# EAGLE design RDF-600 (EAGLE 7.0.0)
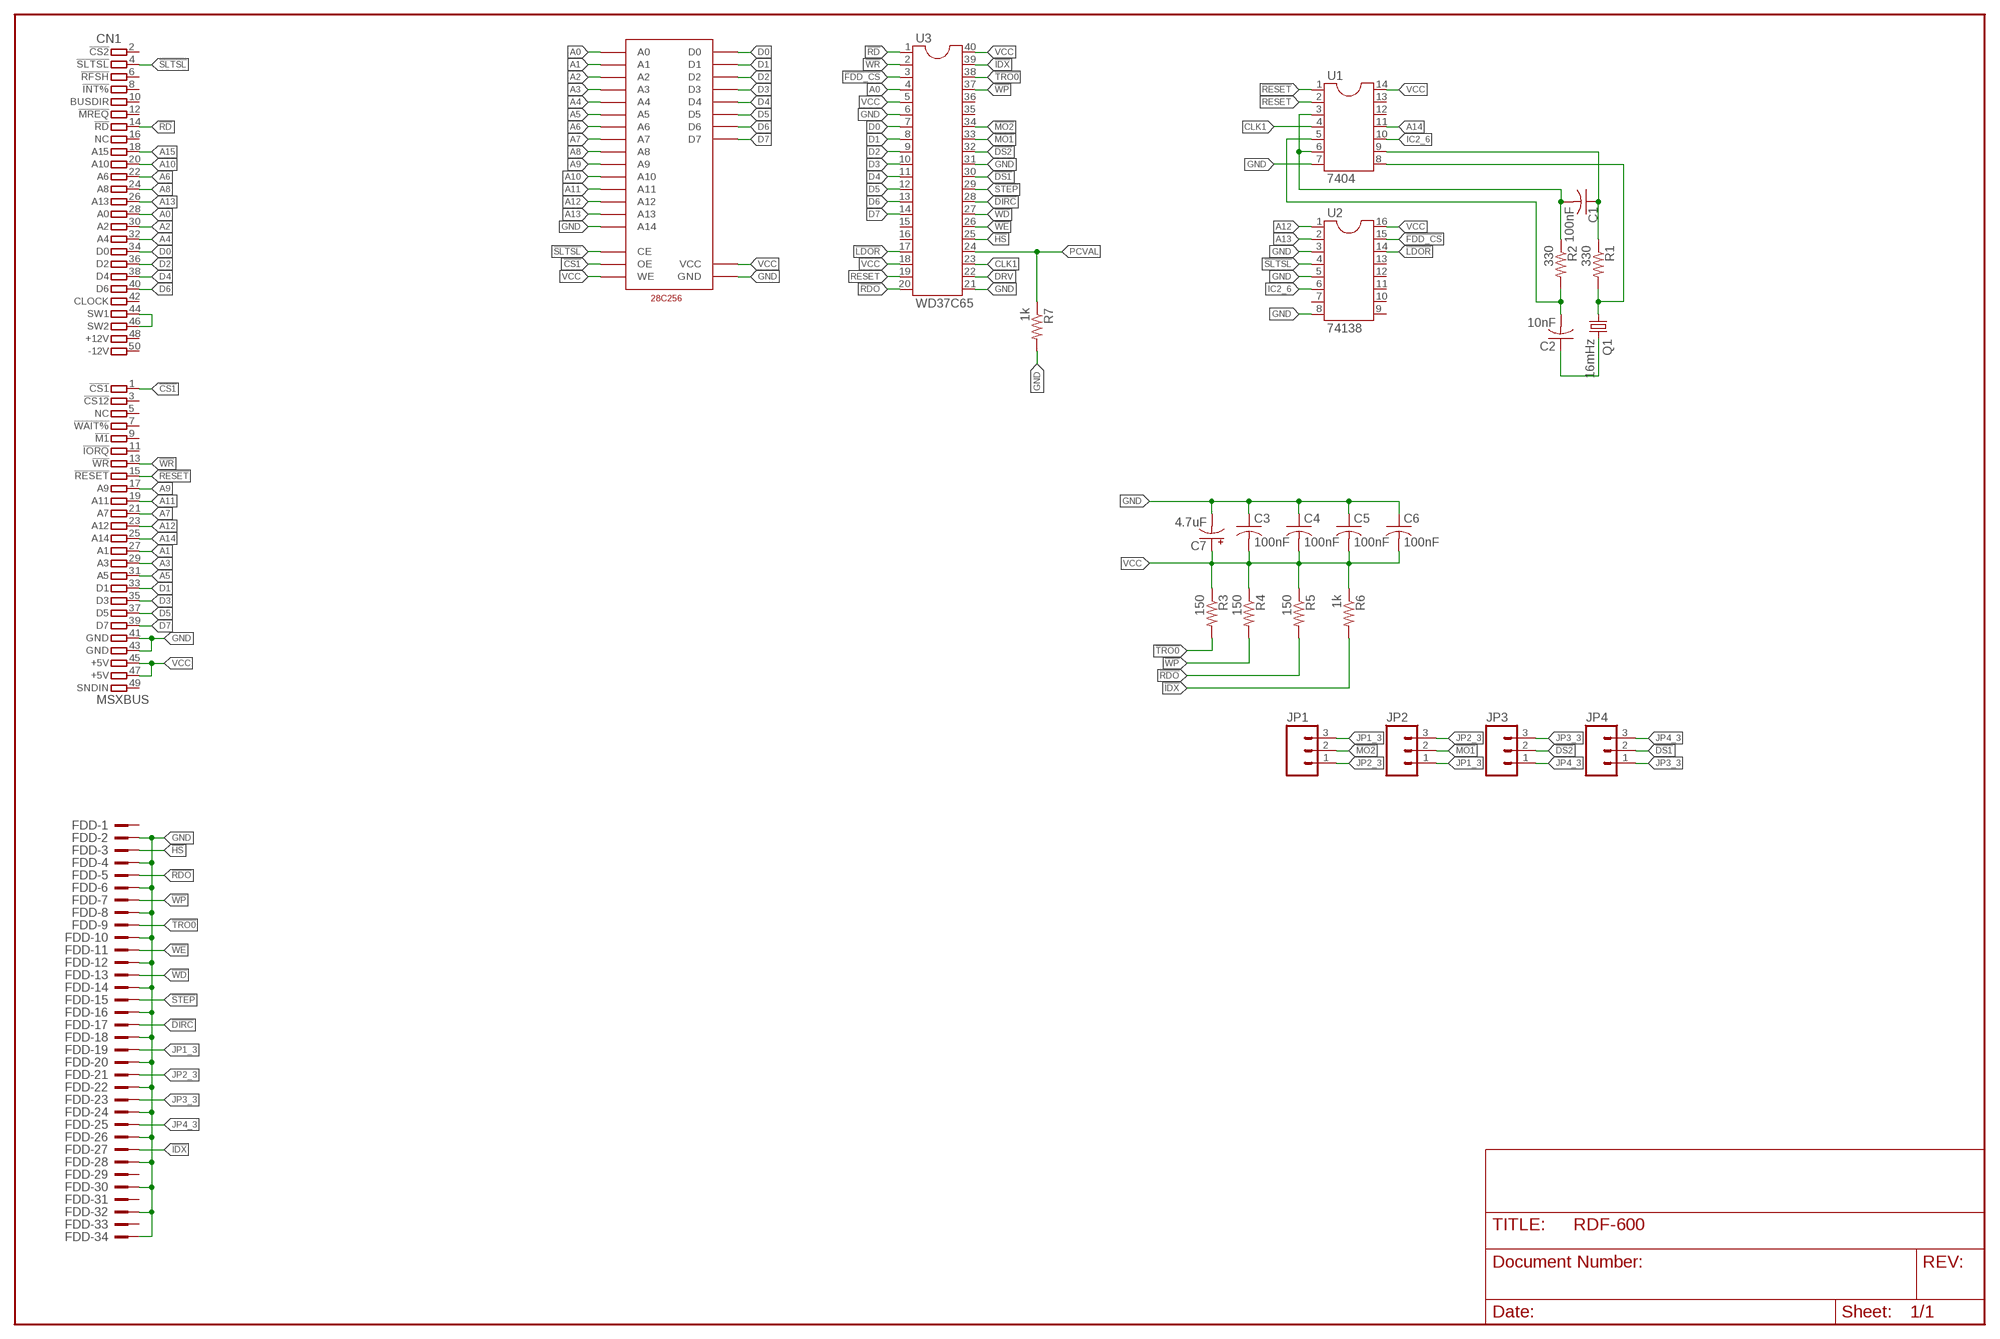
[diagram p0: schematic, sheet 1]

## Parts
28C256  28C256  [DIP28]
C1  100nF  C-US025-025X050  [C025-025X050]
C2  10nF  C-US025-025X050  [C025-025X050]
C3  100nF  C-US025-025X050  [C025-025X050]
C4  100nF  C-US025-025X050  [C025-025X050]
C5  100nF  C-US025-025X050  [C025-025X050]
C6  100nF  C-US025-025X050  [C025-025X050]
C7  4.7uF  CPOL-USE2,5-6E  [E2,5-6E]
CN1  MSXBUS  MSXBUS_EDGE  [MSXBUS_EDGECONN]
FDD  2534-5  [PAK100/2500-5-34]
JP1  M03PTH  [1X03]
JP2  M03PTH  [1X03]
JP3  M03PTH  [1X03]
JP4  M03PTH  [1X03]
Q1  16mHz  CRYSTALHC49S  [HC49/S]
R1  330  R-US_0207/7  [0207/7]
R2  330  R-US_0207/7  [0207/7]
R3  150  R-US_0207/7  [0207/7]
R4  150  R-US_0207/7  [0207/7]
R5  150  R-US_0207/7  [0207/7]
R6  1k  R-US_0207/7  [0207/7]
R7  1k  R-US_0207/7  [0207/7]
U1  7404  DIL14  [DIL14]
U2  74138  DIL16  [DIL16]
U3  WD37C65  DIL40  [DIL40]

## Nets
!CS1: 28C256.P$22(OE) CN1.1(1.!CS1)
!DIRC: FDD.17 U3.28
!DS1: JP4.2 U3.30
!DS2: JP3.2 U3.32
!FDD_CS: U2.15 U3.3
!HS: FDD.3 U3.25
!IDX: FDD.27 R6.2 U3.39
!LDOR: U2.14 U3.17
!MO1: JP2.2 U3.33
!MO2: JP1.2 U3.34
!RD: CN1.14(14.!RD) U3.1
!RDO: FDD.5 R5.2 U3.20
!RESET: CN1.15(15.!RESET) U1.1
!SLTSL: 28C256.P$20(CE) CN1.4(4.!SLTSL) U2.4
!STEP: FDD.15 U3.29
!TRO0: FDD.9 R3.2 U3.38
!WD: FDD.13 U3.27
!WE: FDD.11 U3.26
!WP: FDD.7 R4.2 U3.37
!WR: CN1.13(13.!WR) U3.2
A0: 28C256.P$10(A0) CN1.28(28.A0) U3.4
A1: 28C256.P$9(A1) CN1.27(27.A1)
A2: 28C256.P$8(A2) CN1.30(30.A2)
A3: 28C256.P$7(A3) CN1.29(29.A3)
A4: 28C256.P$6(A4) CN1.32(32.A4)
A5: 28C256.P$5(A5) CN1.31(31.A5)
A6: 28C256.P$4(A6) CN1.22(22.A6)
A7: 28C256.P$3(A7) CN1.21(21.A7)
A8: 28C256.P$25(A8) CN1.24(24.A8)
A9: 28C256.P$24(A9) CN1.17(17.A9)
A10: 28C256.P$21(A10) CN1.20(20.A10)
A11: 28C256.P$23(A11) CN1.19(19.A11)
A12: 28C256.P$2(A12) CN1.23(23.A12) U2.1
A13: 28C256.P$26(A13) CN1.26(26.A13) U2.2
A14: CN1.25(25.A14) U1.11
A15: CN1.18(18.A15)
CLK1: U1.4 U3.23
D0: 28C256.P$11(D0) CN1.34(34.D0) U3.7
D1: 28C256.P$12(D1) CN1.33(33.D1) U3.8
D2: 28C256.P$13(D2) CN1.36(36.D2) U3.9
D3: 28C256.P$15(D3) CN1.35(35.D3) U3.10
D4: 28C256.P$16(D4) CN1.38(38.D4) U3.11
D5: 28C256.P$17(D5) CN1.37(37.D5) U3.12
D6: 28C256.P$18(D6) CN1.40(40.D6) U3.13
D7: 28C256.P$19(D7) CN1.39(39.D7) U3.14
DRV: U3.22
GND: 28C256.P$1(A14) 28C256.P$14(GND) C3.1 C4.1 C5.1 C6.1 C7.- CN1.41(41.GND) CN1.43(43.GND) FDD.2 FDD.4 FDD.6 FDD.8 FDD.10 FDD.12 FDD.14 FDD.16 FDD.18 FDD.20 FDD.22 FDD.24 FDD.26 FDD.28 FDD.30 FDD.32 FDD.34 R7.2 U1.7 U2.3 U2.5 U2.8 U3.6 U3.21 U3.31
IC2_6: U1.10 U2.6
JP1_3: FDD.19 JP1.3 JP2.1
JP2_3: FDD.21 JP1.1 JP2.3
JP3_3: FDD.23 JP3.3 JP4.1
JP4_3: FDD.25 JP3.1 JP4.3
N$1: Q1.1 R1.2 U1.8
N$2: C2.1 Q1.2
N$4: C2.2 R2.2 U1.5
N$5: C1.1 R1.1 U1.9
N$6: C1.2 R2.1 U1.3 U1.6
N$31: CN1.44(44.SW1) CN1.46(46.SW2)
PCVAL: R7.1 U3.24
RESET: U1.2 U3.19
VCC: 28C256.P$27(WE) 28C256.P$28(VCC) C3.2 C4.2 C5.2 C6.2 C7.+ CN1.45(45.+5V) CN1.47(47.+5V) R3.1 R4.1 R5.1 R6.1 U1.14 U2.16 U3.5 U3.18 U3.40
Unconnected: CN1.2(2.!CS2) CN1.3(3.!CS12) CN1.5(5.NC) CN1.6(6.!RFSH) CN1.7(7.!WAIT%) CN1.8(8.!INT%) CN1.9(9.!M1) CN1.10(10.BUSDIR) CN1.11(11.!IORQ) CN1.12(12.!MREQ) CN1.16(16.NC) CN1.42(42.CLOCK) CN1.48(48.+12V) CN1.49(49.SNDIN) CN1.50(50.-12V) FDD.1 FDD.29 FDD.31 FDD.33 U1.12 U1.13 U2.7 U2.9 U2.10 U2.11 U2.12 U2.13 U3.15 U3.16 U3.35 U3.36

## Library data of the parts
28C256 = My_Parts_old+:28C256
C1-C6 = rcl:C-US: CAPACITOR, American symbol
C7 = rcl:CPOL-US: POLARIZED CAPACITOR, American symbol
CN1 = RDF-600:MSXBUS_EDGE: MSX bus (50 pin) edge connector Created 2013 by Eugeny Brychkov
FDD = con-3m:2534-: 3M (TM) Pak 100 4-Wall Header Source: 3M; OC_FARNELL: 9838406; OC_NEWARK: unknown
JP1-JP4 = SparkFun-Connectors:M03: Header 3 Standard 3-pin 0.1" header. Use with straight break away headers (SKU : PRT-00116), right angle break away headers (PRT-00553), swiss pins (PRT-00743), machine pins (PRT-00117), and female headers (PRT-00115). Molex polarized connector foot print use with SKU : PRT-08232 with associated crimp pins and housings.
Q1 = crystal:CRYSTAL: CRYSTAL; OC_FARNELL: 1667008; OC_NEWARK: unknown
R1-R7 = rcl:R-US_: RESISTOR, American symbol
U1 = ic-package:DIL14: Dual In Line / Socket
U2 = ic-package:DIL16: Dual In Line / Socket
U3 = ic-package:DIL40: Dual In Line

## Board
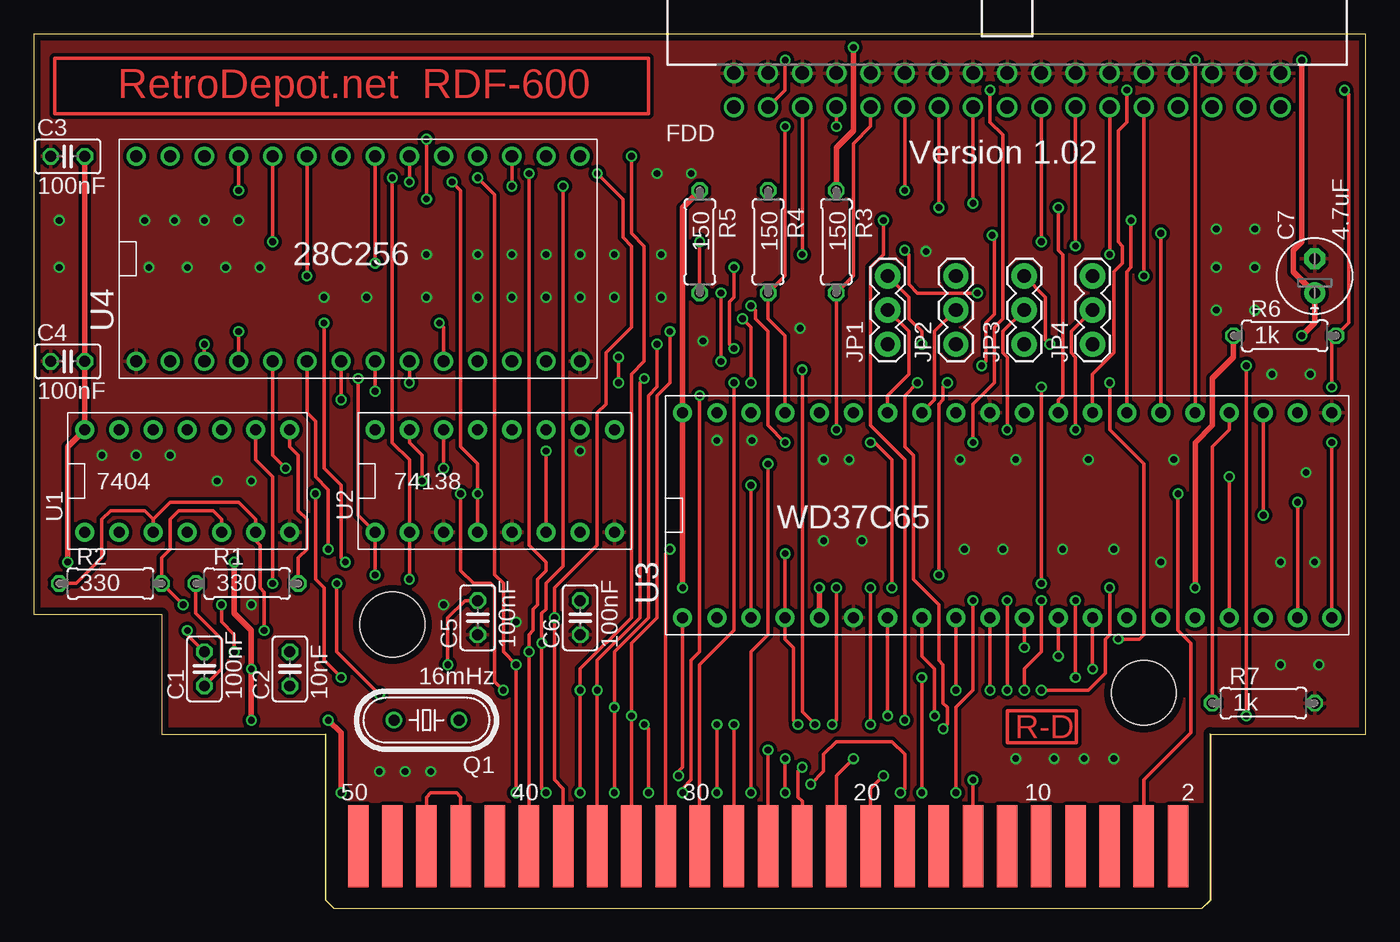
[diagram p1: board, top side]
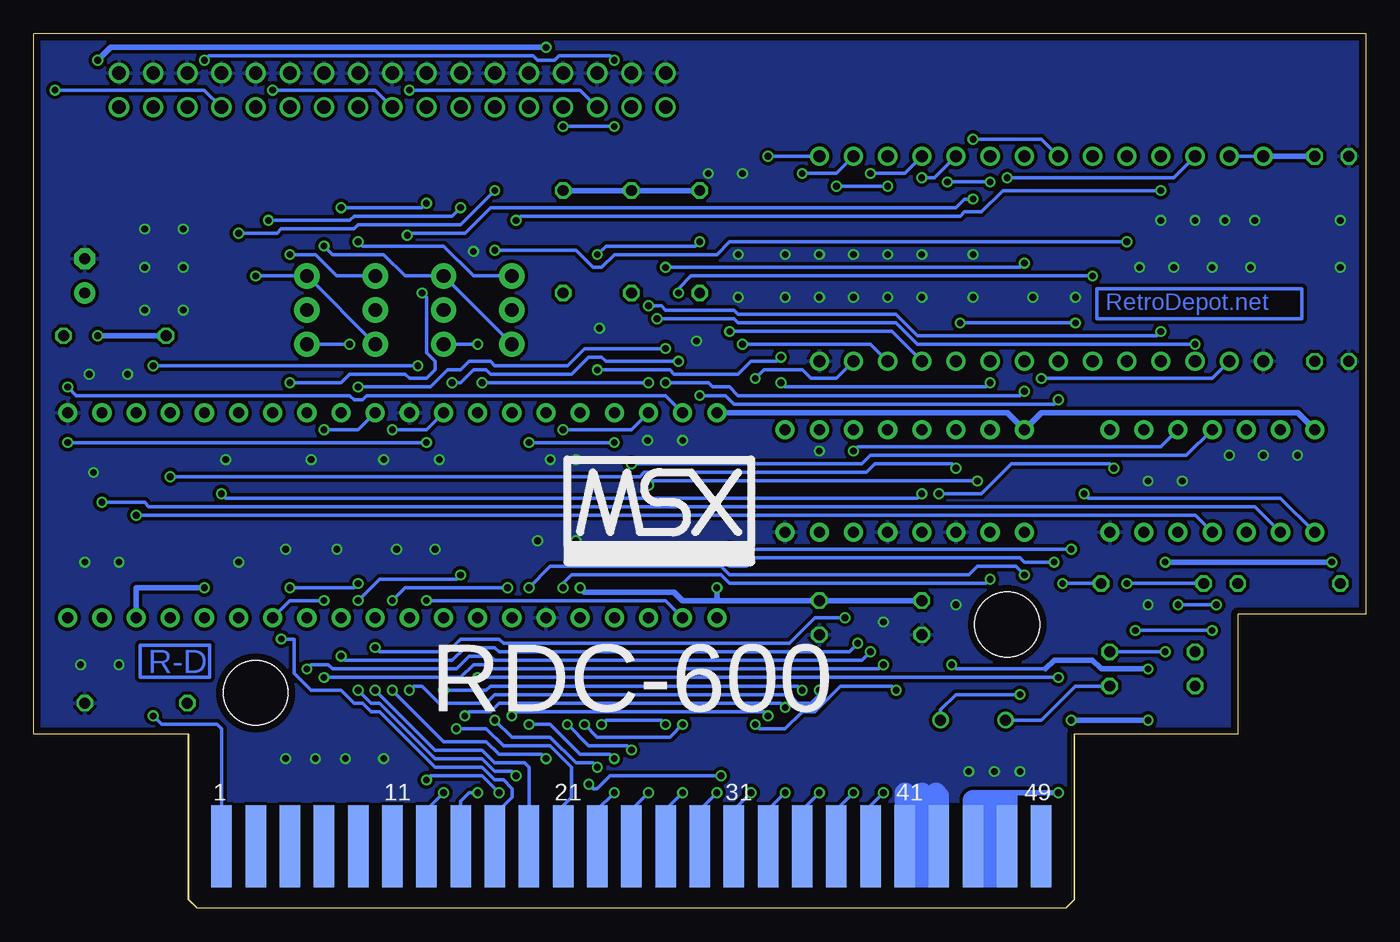
[diagram p2: board, bottom side, seen from below]

Size 99.06 x 65 mm. Coordinates in mm from the lower left corner, seen from the top.
Outline: 87.55,12.94 99.06,12.94 99.06,65 0,65 0,21.84 9.53,21.84 9.53,12.94 21.67,12.94 21.67,0.64 22.3,0 86.92,0 87.55,0.64 87.55,12.94
Copper layers (1*16): Top 0.035mm / dielectric 1.6mm / Bottom 0.035mm
Design rules "JLCPCB-2-layer-rule": minimum track width 5mil, minimum drill 0.2mm, track to track 6mil, track to pad 6mil, pad to pad 6mil, via to via 8mil, smd to smd 0mil, copper to edge 20mil, drill to drill 0.00508125mm, minimum pad ring 6mil, minimum via ring 6mil, stop-mask expansion 0mil, vias tented up to drill 25mil, thermal gap 10mil

### Footprints (pad centres in the part's own frame; a part is rotated, then mirrored left to right if it is on the bottom)
DIP28 = drill 0.9 pad 1.422: P$1 -7.62,16.51; P$2 -7.62,13.97; P$3 -7.62,11.43; P$4 -7.62,8.89; P$5 -7.62,6.35; P$6 -7.62,3.81; P$7 -7.62,1.27; P$8 -7.62,-1.27; P$9 -7.62,-3.81; P$10 -7.62,-6.35; P$11 -7.62,-8.89; P$12 -7.62,-11.43; P$13 -7.62,-13.97; P$14 -7.62,-16.51; P$15 7.62,-16.51; P$16 7.62,-13.97; P$17 7.62,-11.43; P$18 7.62,-8.89; P$19 7.62,-6.35; P$20 7.62,-3.81; P$21 7.62,-1.27; P$22 7.62,1.27; P$23 7.62,3.81; P$24 7.62,6.35; P$25 7.62,8.89; P$26 7.62,11.43; P$27 7.62,13.97; P$28 7.62,16.51
C025-025X050 = drill 0.813 octagon: 1 -1.27,0; 2 1.27,0
E2,5-6E = drill 0.813 pad 1.575: + -1.27,0 | drill 0.813 pad 1.575 octagon: - 1.27,0
MSXBUS_EDGECONN = smd 1.524 x 6.096 bottom: 1 30.48,4.582; 3 27.94,4.582; 5 25.4,4.582; 7 22.86,4.582; 9 20.32,4.582; 11 17.78,4.582; 13 15.24,4.582; 15 12.7,4.582; 17 10.16,4.582; 19 7.62,4.582; 21 5.08,4.582; 23 2.54,4.582; 25 0,4.582; 27 -2.54,4.582; 29 -5.08,4.582; 31 -7.62,4.582; 33 -10.16,4.582; 35 -12.7,4.582; 37 -15.24,4.582; 39 -17.78,4.582; 41 -20.32,4.582; 43 -22.86,4.582; 45 -25.4,4.582; 47 -27.94,4.582; 49 -30.48,4.582 | smd 1.524 x 6.096: 2 30.48,4.582; 4 27.94,4.582; 6 25.4,4.582; 8 22.86,4.582; 10 20.32,4.582; 12 17.78,4.582; 14 15.24,4.582; 16 12.7,4.582; 18 10.16,4.582; 20 7.62,4.582; 22 5.08,4.582; 24 2.54,4.582; 26 0,4.582; 28 -2.54,4.582; 30 -5.08,4.582; 32 -7.62,4.582; 34 -10.16,4.582; 36 -12.7,4.582; 38 -15.24,4.582; 40 -17.78,4.582; 42 -20.32,4.582; 44 -22.86,4.606; 46 -25.4,4.582; 48 -27.94,4.582; 50 -30.48,4.582 | hole 4.826: -27.94,21.082; 27.94,16.002
PAK100/2500-5-34 = drill 1 pad 1.422: 1 -20.32,-1.27; 2 -20.32,1.27; 3 -17.78,-1.27; 4 -17.78,1.27; 5 -15.24,-1.27; 6 -15.24,1.27; 7 -12.7,-1.27; 8 -12.7,1.27; 9 -10.16,-1.27; 10 -10.16,1.27; 11 -7.62,-1.27; 12 -7.62,1.27; 13 -5.08,-1.27; 14 -5.08,1.27; 15 -2.54,-1.27; 16 -2.54,1.27; 17 0,-1.27; 18 0,1.27; 19 2.54,-1.27; 20 2.54,1.27; 21 5.08,-1.27; 22 5.08,1.27; 23 7.62,-1.27; 24 7.62,1.27; 25 10.16,-1.27; 26 10.16,1.27; 27 12.7,-1.27; 28 12.7,1.27; 29 15.24,-1.27; 30 15.24,1.27; 31 17.78,-1.27; 32 17.78,1.27; 33 20.32,-1.27; 34 20.32,1.27
1X03 = drill 1.016 pad 1.88: 1 0,0; 2 2.54,0; 3 5.08,0
HC49/S = drill 0.813: 1 -2.413,0; 2 2.413,0
0207/7 = drill 0.813 octagon: 1 -3.81,0; 2 3.81,0
DIL14 = drill 0.813 pad 1.422: 1 -7.62,-3.81; 2 -5.08,-3.81; 3 -2.54,-3.81; 4 0,-3.81; 5 2.54,-3.81; 6 5.08,-3.81; 7 7.62,-3.81; 8 7.62,3.81; 9 5.08,3.81; 10 2.54,3.81; 11 0,3.81; 12 -2.54,3.81; 13 -5.08,3.81; 14 -7.62,3.81
DIL16 = drill 0.813 pad 1.422: 1 -8.89,-3.81; 2 -6.35,-3.81; 3 -3.81,-3.81; 4 -1.27,-3.81; 5 1.27,-3.81; 6 3.81,-3.81; 7 6.35,-3.81; 8 8.89,-3.81; 9 8.89,3.81; 10 6.35,3.81; 11 3.81,3.81; 12 1.27,3.81; 13 -1.27,3.81; 14 -3.81,3.81; 15 -6.35,3.81; 16 -8.89,3.81
DIL40 = drill 0.813 pad 1.422: 1 -24.13,-7.62; 2 -21.59,-7.62; 3 -19.05,-7.62; 4 -16.51,-7.62; 5 -13.97,-7.62; 6 -11.43,-7.62; 7 -8.89,-7.62; 8 -6.35,-7.62; 9 -3.81,-7.62; 10 -1.27,-7.62; 11 1.27,-7.62; 12 3.81,-7.62; 13 6.35,-7.62; 14 8.89,-7.62; 15 11.43,-7.62; 16 13.97,-7.62; 17 16.51,-7.62; 18 19.05,-7.62; 19 21.59,-7.62; 20 24.13,-7.62; 21 24.13,7.62; 22 21.59,7.62; 23 19.05,7.62; 24 16.51,7.62; 25 13.97,7.62; 26 11.43,7.62; 27 8.89,7.62; 28 6.35,7.62; 29 3.81,7.62; 30 1.27,7.62; 31 -1.27,7.62; 32 -3.81,7.62; 33 -6.35,7.62; 34 -8.89,7.62; 35 -11.43,7.62; 36 -13.97,7.62; 37 -16.51,7.62; 38 -19.05,7.62; 39 -21.59,7.62; 40 -24.13,7.62

### Placement (x,y rotation side)
28C256  24.13,48.26 90 top
C1  12.7,17.78 90 top
C2  19.05,17.78 90 top
C3  2.54,55.88 0 top
C4  2.54,40.64 0 top
C5  33.02,21.59 90 top
C6  40.64,21.59 90 top
C7  95.25,46.99 90 top
CN1  54.61,0 0 top
FDD  72.39,60.8 0 top
JP1  63.5,41.91 90 top
JP2  68.58,41.91 90 top
JP3  73.66,41.91 90 top
JP4  78.74,41.91 90 top
Q1  29.21,13.97 180 top
R1  15.88,24.13 0 top
R2  5.71,24.13 0 top
R3  59.69,49.53 270 top
R4  54.61,49.53 270 top
R5  49.53,49.53 270 top
R6  93.03,42.55 0 top
R7  91.44,15.24 0 top
U1  11.43,31.75 0 top
U2  34.29,31.75 0 top
U3  72.39,29.21 0 top

### Tracks (layer width: path | path; a pad name or v marks a point on that pad's centre or on a via)
!CS1  (via drill 0.5)
  Top 0.254: v90.17,14.29 v90.17,40.32 | v70.48,40.32 70.8,40.64 70.8,43.5 71.44,44.13 71.44,49.85 v71.28,50.01 | v29.21,52.7 v29.21,57.15
  Bottom 0.254: v90.17,14.29 89.54,13.65 85.41,13.65 85.09,13.34 CN1.1 | v90.17,40.32 v70.48,40.32 | v71.28,50.01 71.12,50.16 66.99,50.16 65.09,52.07 30.48,52.07 29.84,52.7 v29.21,52.7 | v29.21,57.15 24.13,57.15 28C256.P$22
!DIRC  (via drill 0.5)
  Top 0.254: U3.28 78.74,39.69 80.33,41.27 80.33,47.31 80.96,47.94 80.96,49.21 80.65,49.53 80.65,57.78 81.28,58.42 v81.28,60.8
  Bottom 0.254: FDD.17 73.66,60.8 v81.28,60.8
!DS1  (via drill 0.5)
  Top 0.254: v77.47,35.56 77.47,40.96 77.15,41.27 77.15,42.86 JP4.2
  Bottom 0.254: U3.30 74.93,35.56 v77.47,35.56
!DS2  (via drill 0.5)
  Top 0.254: v72.39,35.56 72.39,40.96 72.07,41.27 72.07,42.86 JP3.2
  Bottom 0.254: U3.32 69.85,35.56 v72.39,35.56
!FDD_CS  (via drill 0.5)
  Top 0.254: U2.15 27.94,34.61 28.89,33.66 v28.89,31.75 | v53.34,31.43 U3.3
  Bottom 0.254: v28.89,31.75 53.02,31.75 v53.34,31.43
!HS  (via drill 0.5)
  Top 0.254: U3.25 v86.36,63.02 | v55.88,63.02 55.88,60.8 FDD.3
  Bottom 0.254: v55.88,63.02 56.2,63.34 60.01,63.34 60.32,63.02 61.59,63.02 61.91,63.34 86.04,63.34 v86.36,63.02
!IDX  (via drill 0.5)
  Top 0.254: v96.52,38.73 96.52,42.23 R6.2 97.79,43.5 97.79,60.48 v97.47,60.8
  Bottom 0.254: v97.47,60.8 86.36,60.8 FDD.27 | U3.39 52.07,38.1 74.3,38.1 74.61,37.78 75.25,37.78 75.56,38.1 95.89,38.1 v96.52,38.73
!LDOR  (via drill 0.5)
  Top 0.254: U3.17 v88.9,32.07 | v30.48,32.7 U2.14
  Bottom 0.254: v88.9,32.07 53.97,32.07 53.66,32.38 37.15,32.38 36.51,33.02 30.8,33.02 v30.48,32.7
!MO1
  Top 0.254: U3.33 66.99,37.78 66.99,42.86 JP2.2
!MO2
  Top 0.254: U3.34 63.5,38.1 65.09,39.69 65.09,42.86 JP1.2
!RD  (via drill 0.5)
  Top 0.254: U3.1 48.26,10.48 47.94,10.16 v47.94,9.84 | v57.78,9.21 58.74,10.16 58.74,11.43 59.69,12.38 63.82,12.38 64.77,11.43 64.77,8.89 v64.45,8.57 | v69.85,9.53 CN1.14
  Bottom 0.254: v47.94,9.84 56.2,9.84 57.15,8.89 57.47,8.89 v57.78,9.21 | v64.45,8.57 65.72,9.84 69.53,9.84 v69.85,9.53
!RDO  (via drill 0.5)
  Top 0.254: v71.12,60.8 71.12,58.42 72.07,57.47 72.07,43.81 71.44,43.18 71.44,39.05 69.85,37.47 v69.85,34.61 | v96.52,34.61 U3.20 | v57.15,48.58 FDD.5 | v49.53,49.53 R5.2
  Bottom 0.254: FDD.5 58.42,60.8 v71.12,60.8 | v69.85,34.61 v96.52,34.61 | v57.15,48.58 56.51,49.21 49.85,49.21 v49.53,49.53
!RESET  (via drill 0.5)
  Top 0.254: v20.96,30.8 20.96,24.45 21.59,23.81 21.59,18.41 v22.86,17.14 | v66.04,17.14 v66.04,8.57
  Bottom 0.254: U1.1 6.35,30.48 20.64,30.48 v20.96,30.8 | v22.86,17.14 v66.04,17.14 | v66.04,8.57 66.67,8.57 67.31,7.94 CN1.15
!SLTSL  (via drill 0.5)
  Top 0.254: U2.4 v33.02,30.8 33.02,33.02 31.75,34.29 31.75,53.34 v31.11,53.98 | v85.09,30.8 85.09,20.64 86.04,19.68 86.04,13.02 82.55,9.53 CN1.4 | v27.94,53.98 28C256.P$20
  Bottom 0.254: v33.02,30.8 33.34,30.48 84.77,30.48 v85.09,30.8 | v31.11,53.98 v27.94,53.98
!STEP  (via drill 0.5)
  Top 0.254: U3.29 76.2,37.78 76.52,38.1 76.52,48.58 76.2,48.9 v76.2,52.07 | v69.85,52.39 FDD.15
  Bottom 0.254: v76.2,52.07 70.17,52.07 v69.85,52.39
!TRO0  (via drill 0.5)
  Top 0.254: FDD.9 62.23,58.1 60.96,56.83 60.96,46.99 R3.2 v59.69,35.56
  Bottom 0.254: U3.38 54.61,35.56 v59.69,35.56
!WD  (via drill 0.5)
  Top 0.254: v81.6,51.12 81.6,47.62 81.28,47.31 U3.27 | v67.31,52.07 FDD.13
  Bottom 0.254: v81.6,51.12 75.56,51.12 75.25,51.44 67.95,51.44 v67.31,52.07
!WE  (via drill 0.5)
  Top 0.254: v83.82,50.16 U3.26 | v64.77,53.34 FDD.11
  Bottom 0.254: v83.82,50.16 80.96,50.16 80.65,50.48 75.25,50.48 74.93,50.8 67.31,50.8 v64.77,53.34
!WP  (via drill 0.5)
  Top 0.254: v59.69,58.1 FDD.7 | U3.37 55.88,42.55 54.61,43.81 R4.2 55.88,46.99 v55.88,58.1
  Bottom 0.254: v55.88,58.1 v59.69,58.1
!WR  (via drill 0.5)
  Top 0.254: v69.85,22.86 69.85,16.19 68.58,14.92 v68.58,8.57
  Bottom 0.254: U3.2 52.07,22.86 v69.85,22.86 | v68.58,8.57 69.85,7.3 CN1.13
A0  (via drill 0.5)
  Top 0.254: v56.83,13.65 56.51,13.97 56.51,19.37 55.88,20 U3.4 v55.88,26.35 | v52.07,13.65 CN1.28 | 28C256.P$10 30.48,43.18 v30.16,43.5 | v21.59,43.5 21.59,32.7 22.86,31.43 22.86,26.04 v23.18,25.72
  Bottom 0.254: v56.83,13.65 56.51,13.97 52.39,13.97 v52.07,13.65 | v30.16,43.5 v21.59,43.5 | v23.18,25.72 25.4,25.72 25.72,26.04 45.4,26.04 46.04,25.4 47.31,25.4 47.94,26.04 55.56,26.04 v55.88,26.35
A1  (via drill 0.5)
  Top 0.254: v50.8,8.57 v50.8,13.65 | v58.1,13.65 57.15,14.61 v57.15,40.01 | v43.5,40.96 v43.5,39.05 | v27.94,39.05 28C256.P$9
  Bottom 0.254: CN1.27 52.07,7.3 v50.8,8.57 | v50.8,13.65 51.75,12.7 57.15,12.7 v58.1,13.65 | v57.15,40.01 51.75,40.01 51.43,39.69 46.67,39.69 45.72,40.64 43.81,40.64 v43.5,40.96 | v43.5,39.05 43.18,38.73 28.26,38.73 v27.94,39.05
A2  (via drill 0.5)
  Top 0.254: CN1.30 49.53,18.1 52.07,20.64 v52.07,39.05 | v25.4,38.42 28C256.P$8
  Bottom 0.254: v52.07,39.05 48.89,39.05 48.58,38.73 47.31,38.73 46.67,38.1 25.72,38.1 v25.4,38.42
A3  (via drill 0.5)
  Top 0.254: v49.53,38.1 49.53,19.05 48.89,18.41 48.89,9.53 48.26,8.89 v48.26,8.57 | v22.86,37.78 28C256.P$7
  Bottom 0.254: CN1.29 49.53,7.3 v48.26,8.57 | v49.53,38.1 47.62,38.1 46.99,37.47 23.18,37.47 v22.86,37.78
A4  (via drill 0.5)
  Top 0.254: CN1.32 46.99,26.35 v47.31,26.67 | v21.91,26.67 21.91,31.11 20.96,32.07 20.96,36.2 20.32,36.83 28C256.P$6
  Bottom 0.254: v47.31,26.67 v21.91,26.67
A5  (via drill 0.5)
  Top 0.254: v45.72,8.57 45.72,13.34 v45.4,13.65 | v31.75,30.8 31.75,25.08 32.7,24.13 33.97,24.13 34.29,23.81 34.29,16.83 v34.92,16.19 | v18.73,32.7 17.78,33.66 28C256.P$5
  Bottom 0.254: CN1.31 46.99,7.3 v45.72,8.57 | v34.92,16.19 35.24,16.51 39.05,16.51 40.96,14.61 41.91,14.61 43.18,13.34 45.08,13.34 v45.4,13.65 | v31.75,30.8 28.57,30.8 26.35,33.02 19.05,33.02 v18.73,32.7
A6  (via drill 0.5)
  Top 0.254: CN1.22 59.69,9.84 v60.96,11.11 | v72.39,16.19 v72.39,22.86 | v55.88,34.61 54.61,35.88 54.61,42.86 53.66,43.81 53.66,44.45 v53.34,44.77 | v15.24,42.86 28C256.P$4 | v62.23,34.61 62.55,34.61 63.82,33.34 v63.82,23.81
  Bottom 0.254: v60.96,11.11 61.28,11.43 64.45,11.43 65.41,12.38 68.58,12.38 v72.39,16.19 | v72.39,22.86 71.44,23.81 v63.82,23.81 | v53.34,44.77 52.39,44.77 52.07,44.45 46.99,44.45 46.67,44.13 34.92,44.13 33.34,42.55 15.56,42.55 v15.24,42.86 | v62.23,34.61 v55.88,34.61
A7  (via drill 0.5)
  Top 0.254: v67.63,13.34 67.95,13.65 67.95,14.92 67.63,15.24 67.63,18.1 67.31,18.41 67.31,22.54 65.41,24.45 65.41,33.66 64.77,34.29 64.77,38.1 v65.72,39.05 | v12.7,41.91 28C256.P$3 | v53.34,39.05 53.34,43.18 v52.7,43.81
  Bottom 0.254: CN1.21 59.69,7.62 59.05,8.26 59.05,10.48 60.64,12.06 64.14,12.06 65.41,13.34 v67.63,13.34 | v65.72,39.05 v53.34,39.05 | v12.7,41.91 33.34,41.91 34.92,43.5 46.67,43.5 46.99,43.81 v52.7,43.81
A8  (via drill 0.5)
  Top 0.254: v64.77,13.97 64.77,33.34 62.23,35.88 62.23,47.62 63.18,48.58 v63.18,51.12 | v15.24,53.34 28C256.P$25 | CN1.24 57.15,7.94 56.83,8.26 56.83,10.16 v57.15,10.48
  Bottom 0.254: v57.15,10.48 57.47,10.79 58.74,10.79 60.64,12.7 63.5,12.7 v64.77,13.97 | v63.18,51.12 62.87,51.44 30.16,51.44 29.84,51.75 28.57,51.75 26.99,53.34 v15.24,53.34
A9  (via drill 0.5)
  Top 0.254: v80.65,20 82.23,20 82.55,20.32 82.55,33.02 80.01,35.56 v80.01,39.05 | v70.17,45.72 65.72,45.72 65.09,46.35 65.09,48.58 v64.77,48.9 | v17.78,49.53 28C256.P$24
  Bottom 0.254: v80.65,20 79.69,20 79.69,17.46 78.42,16.19 76.2,16.19 75.25,15.24 74.61,15.24 73.98,14.61 73.34,14.61 69.22,10.48 65.72,10.48 64.77,9.53 64.14,9.53 63.5,8.89 63.5,8.26 64.77,6.99 CN1.17 | v80.01,39.05 76.2,39.05 75.56,39.69 71.44,39.69 71.12,39.37 69.85,39.37 69.22,40.01 69.22,40.64 69.85,41.27 69.85,45.4 v70.17,45.72 | v64.77,48.9 58.74,48.9 57.47,47.62 56.83,47.62 55.88,48.58 48.26,48.58 47.31,49.53 v17.78,49.53
A10  (via drill 0.5)
  Top 0.254: CN1.20 62.23,8.89 v63.18,9.84 | v74.93,16.19 78.42,16.19 79.69,17.46 79.69,20 80.01,20.32 v80.01,23.81 | v74.93,24.13 v74.93,38.73 | v52.07,41.59 51.75,41.91 51.75,45.09 52.07,45.4 v52.07,47.62 | v25.4,47.94 28C256.P$21
  Bottom 0.254: v63.18,9.84 63.5,10.16 64.77,10.16 65.72,11.11 69.22,11.11 73.34,15.24 73.98,15.24 v74.93,16.19 | v80.01,23.81 75.25,23.81 v74.93,24.13 | v74.93,38.73 69.53,38.73 68.26,40.01 67.31,40.01 66.67,40.64 65.09,40.64 64.77,40.32 59.37,40.32 58.1,41.59 v52.07,41.59 | v52.07,47.62 25.72,47.62 v25.4,47.94
A11  (via drill 0.5)
  Top 0.254: v73.66,16.19 73.66,17.78 74.93,19.05 v74.93,22.86 | v67.31,24.77 67.31,37.47 67.63,37.78 67.63,38.73 v67.95,39.05 | v51.12,40.64 v51.12,45.72 | v20.32,46.99 28C256.P$23
  Bottom 0.254: CN1.19 62.23,10.48 62.55,10.79 64.77,10.79 65.72,11.75 69.22,11.75 v73.66,16.19 | v74.93,22.86 73.34,24.45 67.63,24.45 v67.31,24.77 | v67.95,39.05 67.31,39.05 66.36,40.01 65.41,40.01 65.09,39.69 59.05,39.69 57.78,40.96 56.83,40.96 56.51,40.64 v51.12,40.64 | v51.12,45.72 51.12,46.04 50.16,46.99 v20.32,46.99
A12  (via drill 0.5)
  Top 0.254: v24.13,39.37 24.13,29.21 U2.1 v25.4,24.77 | v55.88,8.57 v55.88,11.11 | v62.23,13.65 v62.23,23.81
  Bottom 0.254: v24.13,39.37 11.43,39.37 28C256.P$2 | CN1.23 57.15,7.3 v55.88,8.57 | v55.88,11.11 56.2,11.43 58.42,11.43 60.64,13.65 v62.23,13.65 | v62.23,23.81 60.64,25.4 47.94,25.4 47.31,24.77 29.53,24.77 28.89,25.4 26.04,25.4 v25.4,24.77
A13  (via drill 0.5)
  Top 0.254: v26.67,54.29 26.67,34.61 27.94,33.34 U2.2 v27.94,24.45 | CN1.26 v54.61,11.75 | v59.37,13.65 59.69,13.97 v59.69,23.81
  Bottom 0.254: v26.67,54.29 14.29,54.29 28C256.P$26 | v54.61,11.75 54.93,12.06 57.78,12.06 v59.37,13.65 | v59.69,23.81 59.69,24.13 59.05,24.77 47.94,24.77 47.31,24.13 28.26,24.13 v27.94,24.45
A14  (via drill 0.5)
  Top 0.254: v54.61,33.02 54.61,20.32 53.34,19.05 v53.34,8.57
  Bottom 0.254: U1.11 13.34,33.66 36.83,33.66 37.46,33.02 v54.61,33.02 | CN1.25 54.61,7.3 v53.34,8.57
CLK1  (via drill 0.5)
  Top 0.254: v91.44,29.21 U3.23
  Bottom 0.254: U1.4 12.7,29.21 v91.44,29.21
D0  (via drill 0.5)
  Top 0.254: CN1.34 v44.45,14.29 44.45,19.68 46.35,21.59 46.35,38.1 47.31,39.05 v47.31,42.86 | v63.5,14.29 U3.7
  Bottom 0.254: v47.31,42.86 35.24,42.86 28C256.P$11 | v63.5,14.29 63.18,14.61 44.77,14.61 v44.45,14.29
D1  (via drill 0.5)
  Top 0.254: v43.18,8.57 v43.18,14.92 43.18,19.05 45.72,21.59 45.72,38.1 46.35,38.73 v46.35,41.91 | v66.99,14.29 66.99,17.78 66.04,18.73 U3.8
  Bottom 0.254: CN1.33 44.45,7.3 v43.18,8.57 | v46.35,41.91 36.83,41.91 28C256.P$12 | v43.18,14.92 43.5,15.24 64.45,15.24 65.09,14.61 66.67,14.61 v66.99,14.29
D2  (via drill 0.5)
  Top 0.254: CN1.36 v41.91,16.19 41.91,18.41 45.08,21.59 45.08,39.05 v45.4,39.37 | v68.58,16.19 U3.9
  Bottom 0.254: v41.91,16.19 42.23,16.51 65.09,16.51 65.41,16.19 v68.58,16.19 | 28C256.P$13 39.37,39.37 41.27,39.37 41.91,40.01 44.77,40.01 v45.4,39.37
D3  (via drill 0.5)
  Top 0.254: v40.64,8.57 v40.64,16.19 40.64,17.78 44.45,21.59 44.45,39.69 45.4,40.64 45.4,49.21 44.45,50.16 v44.45,55.88 | v71.12,16.19 U3.10
  Bottom 0.254: CN1.35 41.91,7.3 v40.64,8.57 | v40.64,16.19 40.64,15.88 41.27,15.24 42.23,15.24 42.86,15.88 64.77,15.88 65.41,15.24 68.9,15.24 70.17,16.51 70.8,16.51 v71.12,16.19 | v44.45,55.88 28C256.P$15
D4  (via drill 0.5)
  Top 0.254: CN1.38 39.37,8.89 38.73,9.53 v38.73,21.59 38.73,23.81 41.91,26.99 41.91,36.83 42.54,37.47 42.54,41.27 44.45,43.18 44.45,49.21 43.81,49.85 43.81,52.7 v41.91,54.61 | v73.66,19.37 U3.11
  Bottom 0.254: v41.91,54.61 39.37,54.61 28C256.P$16 | v38.73,21.59 40.96,21.59 42.86,19.68 64.14,19.68 64.45,20 67.31,20 68.26,19.05 73.34,19.05 v73.66,19.37
D5  (via drill 0.5)
  Top 0.254: v38.1,8.57 37.78,8.89 v37.78,19.68 37.78,21.91 38.1,22.23 38.1,24.13 39.37,25.4 v39.37,53.66 | v35.56,53.66 28C256.P$17 | v76.2,18.73 U3.12
  Bottom 0.254: CN1.37 39.37,7.3 v38.1,8.57 | v39.37,53.66 v35.56,53.66 | v37.78,19.68 38.42,19.05 64.45,19.05 64.77,19.37 66.99,19.37 67.95,18.41 75.88,18.41 v76.2,18.73
D6  (via drill 0.5)
  Top 0.254: CN1.40 v36.83,19.05 36.83,20.32 37.15,20.64 37.15,22.23 37.46,22.54 37.46,24.45 38.1,25.08 38.1,25.72 36.83,26.99 v36.83,54.61 | v78.74,17.78 U3.13
  Bottom 0.254: v36.83,54.61 34.29,54.61 28C256.P$18 | v36.83,19.05 37.46,18.41 64.77,18.41 65.09,18.73 66.67,18.73 67.63,17.78 76.84,17.78 77.15,18.1 78.42,18.1 v78.74,17.78
D7  (via drill 0.5)
  Top 0.254: v35.88,8.57 v35.88,18.1 34.92,19.05 34.92,24.13 34.29,24.77 34.29,53.02 v33.02,54.29 | v77.47,17.14 v77.47,22.86
  Bottom 0.254: CN1.39 36.83,7.62 v35.88,8.57 | v33.02,54.29 32.07,54.29 28C256.P$19 | v77.47,22.86 80.01,22.86 U3.14 | v35.88,18.1 36.2,17.78 65.09,17.78 65.41,18.1 66.36,18.1 67.31,17.14 v77.47,17.14
GND  (via drill 0.5)
  Bottom 1.524: 33.02,2.3 31.75,2.3 CN1.43 31.75,8.33 31.99,8.57 | 33.02,2.3 34.29,2.3 34.29,8.57 | 33.02,2.3 33.02,8.57
  other vias: 58.74,33.34 60.64,33.34 58.74,27.3 61.59,27.3 76.52,26.67 80.33,26.67 72.07,26.67 69.22,26.67 68.9,33.34 73.03,33.34 84.77,33.34 83.82,25.72 73.03,11.11 75.88,11.11 78.11,11.11 80.33,11.11 87.95,50.48 90.81,50.48 87.95,47.62 90.81,47.62 87.95,44.45 90.81,44.45 92.08,39.69 94.93,39.69 92.71,18.1 78.42,33.34 94.62,32.38 92.71,25.72 95.25,25.72 95.57,18.1 25.72,10.16 27.62,10.16 29.53,10.16 30.48,22.54 5.08,33.66 7.62,33.66 10.16,33.66 13.65,31.75 16.19,31.75 1.9,51.12 1.9,47.62 8.26,51.12 8.57,47.62 10.48,51.12 11.43,47.62 12.7,51.12 14.29,47.62 15.24,51.12 16.83,47.62 21.59,45.4 24.77,45.4 29.21,48.58 29.21,45.4 40.64,33.97 46.67,48.58 46.67,45.4 43.18,48.58 43.18,45.4 40.64,48.58 40.64,45.4 38.1,48.58 38.1,45.4 35.56,48.58 35.56,45.4 33.02,48.58 33.02,45.4 46.35,54.61 48.89,54.61 35.88,21.27 66.36,48.82 56.99,43.1 49.77,42.15 50.8,34.77 53.42,34.77 16.19,22.54
  pour Top (isolate 0.254): 99.38,7.94 -0.32,7.94 -0.32,67 99.38,67
  pour Bottom (isolate 0.254): 31.11,7.46 31.11,7.94 -0.32,7.94 -0.32,67 99.38,67 99.38,7.94 34.92,7.94 34.92,7.46
IC2_6  (via drill 0.5)
  Top 0.254: v38.1,33.97 U2.6
  Bottom 0.254: U1.10 15.24,34.29 37.78,34.29 v38.1,33.97
JP1_3  (via drill 0.5)
  Top 0.254: v66.04,41.91 66.04,42.86 65.09,43.81 65.09,45.4 JP1.3 | v74.93,49.53 FDD.19
  Bottom 0.254: JP2.1 v66.04,41.91 | JP1.3 66.36,46.99 68.58,49.21 74.61,49.21 v74.93,49.53
JP2_3  (via drill 0.5)
  Top 0.254: v77.47,49.21 FDD.21
  Bottom 0.254: JP1.1 JP2.3 71.44,46.99 73.03,48.58 76.84,48.58 v77.47,49.21
JP3_3  (via drill 0.5)
  Top 0.254: v75.56,41.91 75.25,42.23 75.25,45.4 JP3.3 | v80.01,48.58 FDD.23
  Bottom 0.254: JP4.1 v75.56,41.91 | JP3.3 76.52,46.99 78.11,48.58 v80.01,48.58
JP4_3  (via drill 0.5)
  Top 0.254: v82.55,46.99 FDD.25
  Bottom 0.254: JP3.1 JP4.3 v82.55,46.99
N$1  (via drill 0.5)
  Top 0.254: R1.2 19.68,26.04 20.32,26.67 20.32,28.89 19.68,29.53 19.68,33.66 19.05,34.29 U1.8 | v22.54,24.13 22.54,19.05 v25.72,15.88
  Bottom 0.254: R1.2 v22.54,24.13 | v25.72,15.88 30.48,15.88 31.62,14.73 Q1.1
N$2
  Bottom 0.254: C2.1 21.59,16.51 24.13,13.97 Q1.2
N$4  (via drill 0.5)
  Top 0.254: v14.92,19.05 14.92,20.32 13.97,21.27 v13.97,22.54 | U1.5 13.97,28.89 13.34,29.53 10.79,29.53 10.16,28.89 10.16,26.67 9.53,26.04 R2.2 v11.11,22.54
  Bottom 0.254: v14.92,19.05 C2.2 | v11.11,22.54 v13.97,22.54
N$5  (via drill 0.5)
  Top 0.254: C1.1 13.97,17.78 13.97,20 12.07,21.91 R1.1 | v17.78,24.13 17.78,32.07 16.51,33.34 U1.9
  Bottom 0.254: R1.1 v17.78,24.13
N$6  (via drill 0.5)
  Top 0.254: v11.43,20.64 11.43,20.32 C1.2 | R2.1 3.18,24.13 5.08,26.04 5.08,28.89 5.71,29.53 8.26,29.53 8.89,28.89 | 8.89,28.89 U1.3 | 8.89,28.89 10.16,30.16 15.24,30.16 16.51,28.89 U1.6 16.51,27.3 16.83,26.99 16.83,23.81 17.14,23.5 v17.14,20.64
  Bottom 0.254: v17.14,20.64 v11.43,20.64
N$7
  Top 0.254: 72.39,12.3 72.39,14.68 77.55,14.68 77.55,12.3 72.39,12.3
N$8
  Bottom 0.254: 91.12,17.14 91.12,19.53 85.96,19.53 85.96,17.14 91.12,17.14
N$9
  Bottom 0.254: 20,43.81 20,46.04 4.76,46.04 4.76,43.81 20,43.81
N$10
  Top 0.254: 1.59,59.05 45.72,59.05 45.72,63.18 1.59,63.18 1.59,59.05
N$31
  Top 0.254: CN1.44 31.75,8.26 31.43,8.57 29.53,8.57 29.21,8.26 CN1.46
PCVAL
  Top 0.254: R7.1 87.63,34.29 88.9,35.56 U3.24
RESET  (via drill 0.5)
  Top 0.254: v93.98,30.16 U3.19
  Bottom 0.254: U1.2 8.26,29.84 90.49,29.84 90.81,30.16 v93.98,30.16
VCC  (via drill 0.5)
  Top 0.254: v30.8,18.1 30.8,21.59 32.07,22.86 C5.2
  Top 0.406: C3.2 C4.2 U1.14 2.54,34.29 v2.54,25.72 | v22.86,8.57 22.86,13.02 v21.91,13.97 | v16.19,13.97 v16.19,17.78 16.19,20.64 14.92,21.91 v14.92,25.72 | v94.3,63.02 94.3,49.53 93.66,48.9 93.66,47.31 C7.+ 95.25,43.5 v94.3,42.55 | v58.42,23.81 U3.5 | v48.26,23.81 U3.40 48.26,52.07 R5.1 | v60.96,63.98 60.96,57.78 59.69,56.52 R3.1 | v86.36,23.81 86.36,34.61 87.63,35.88 87.63,39.37 89.22,40.96 R6.1
  Bottom 0.254: 28C256.P$27 28C256.P$28 | 23.81,17.78 30.48,17.78 v30.8,18.1
  Bottom 0.406: C3.2 28C256.P$28 | U1.14 5.08,36.83 24.13,36.83 U2.16 26.67,36.83 U3.40 | CN1.45 29.21,6.35 29.21,7.94 28.57,8.57 26.67,8.57 | 26.67,8.57 26.67,8.02 | 26.67,6.59 CN1.47 | 26.67,8.57 26.11,8.57 | 26.11,8.57 v22.86,8.57 | v21.91,13.97 v16.19,13.97 | v14.92,25.72 v2.54,25.72 | 48.26,22.86 C6.2 C5.2 | 48.26,22.86 50.8,22.86 51.43,23.5 58.1,23.5 v58.42,23.81 | 23.81,17.78 23.18,18.41 20.32,18.41 19.68,17.78 v16.19,17.78 | v48.26,23.81 48.26,22.86 | v60.96,63.98 93.34,63.98 v94.3,63.02 | 26.11,8.57 26.11,7.94 | R3.1 R4.1 R5.1 | U3.18 91.44,23.81 v86.36,23.81 | R6.1 v94.3,42.55
  Bottom 1.524: CN1.47 26.67,2.3 29.21,2.3 | 26.67,6.59 26.67,8.02 27.94,8.02 | 29.21,6.35 29.21,8.02 27.94,8.02 | 27.94,8.02 27.86,3.41

### Text on the board
Top: RetroDepot.net RDF-600 | R-D
Bottom: RetroDepot.net | R-D
tPlace: Version 1.02 | U4
bPlace: RDC-600